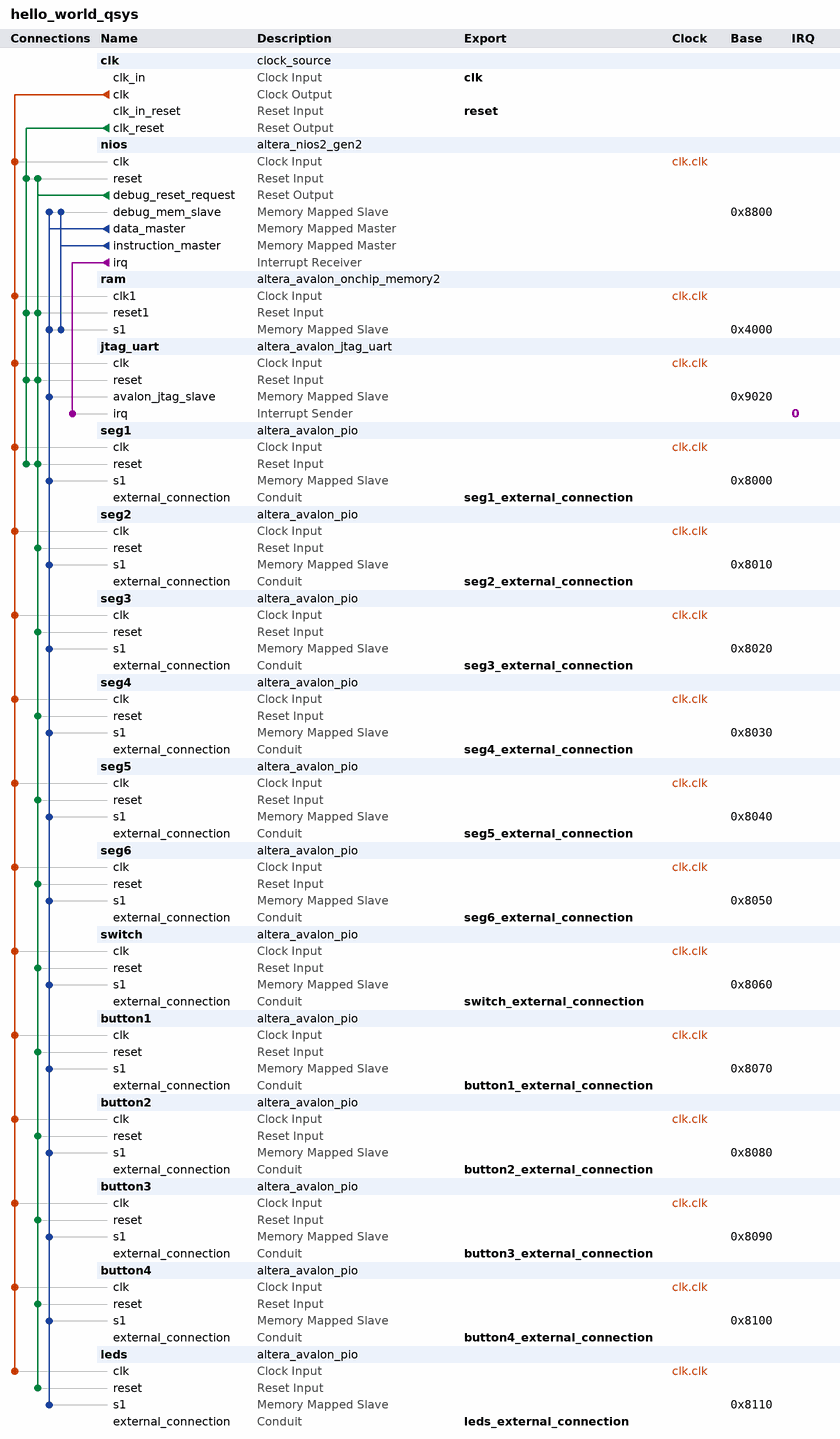
[diagram p0: system contents]
# Platform Designer (Qsys) system hello_world_qsys, Cyclone V 5CSEMA5F31C6
# Parameters at their usual value, and those the tool derives, are not listed.
package require -exact qsys 17.0
create_system hello_world_qsys
set_project_property DEVICE_FAMILY {Cyclone V}
set_project_property DEVICE 5CSEMA5F31C6

add_instance clk clock_source 17.0
set_instance_parameter_value clk clockFrequency 50000000

add_instance nios altera_nios2_gen2 17.0
set_instance_parameter_value nios dcache_size 2048
set_instance_parameter_value nios exceptionSlave ram.s1
set_instance_parameter_value nios icache_size 4096
set_instance_parameter_value nios impl Tiny
set_instance_parameter_value nios resetSlave ram.s1

add_instance ram altera_avalon_onchip_memory2 17.0
set_instance_parameter_value ram dataWidth 32
set_instance_parameter_value ram dualPort false
set_instance_parameter_value ram initMemContent false
set_instance_parameter_value ram initializationFileName onchip_mem.hex
set_instance_parameter_value ram memorySize 16384

add_instance jtag_uart altera_avalon_jtag_uart 17.0
set_instance_parameter_value jtag_uart simInteractiveOptions NO_INTERACTIVE_WINDOWS

add_instance seg1 altera_avalon_pio 17.0
set_instance_parameter_value seg1 direction Output
set_instance_parameter_value seg1 width 7

add_instance seg2 altera_avalon_pio 17.0
set_instance_parameter_value seg2 direction Output
set_instance_parameter_value seg2 width 7

add_instance seg3 altera_avalon_pio 17.0
set_instance_parameter_value seg3 direction Output
set_instance_parameter_value seg3 width 7

add_instance seg4 altera_avalon_pio 17.0
set_instance_parameter_value seg4 direction Output
set_instance_parameter_value seg4 width 7

add_instance seg5 altera_avalon_pio 17.0
set_instance_parameter_value seg5 direction Output
set_instance_parameter_value seg5 width 7

add_instance seg6 altera_avalon_pio 17.0
set_instance_parameter_value seg6 direction Output
set_instance_parameter_value seg6 width 7

add_instance switch altera_avalon_pio 17.0
set_instance_parameter_value switch direction Input
set_instance_parameter_value switch width 1

add_instance button1 altera_avalon_pio 17.0
set_instance_parameter_value button1 direction Input
set_instance_parameter_value button1 width 1

add_instance button2 altera_avalon_pio 17.0
set_instance_parameter_value button2 direction Input
set_instance_parameter_value button2 width 1

add_instance button3 altera_avalon_pio 17.0
set_instance_parameter_value button3 direction Input
set_instance_parameter_value button3 width 1

add_instance button4 altera_avalon_pio 17.0
set_instance_parameter_value button4 direction Input
set_instance_parameter_value button4 width 1

add_instance leds altera_avalon_pio 17.0
set_instance_parameter_value leds direction Output
set_instance_parameter_value leds width 5

# connections
add_connection clk.clk button1.clk clock
add_connection clk.clk button2.clk clock
add_connection clk.clk button3.clk clock
add_connection clk.clk button4.clk clock
add_connection clk.clk jtag_uart.clk clock
add_connection clk.clk leds.clk clock
add_connection clk.clk nios.clk clock
add_connection clk.clk ram.clk1 clock
add_connection clk.clk seg1.clk clock
add_connection clk.clk seg2.clk clock
add_connection clk.clk seg3.clk clock
add_connection clk.clk seg4.clk clock
add_connection clk.clk seg5.clk clock
add_connection clk.clk seg6.clk clock
add_connection clk.clk switch.clk clock
add_connection clk.clk_reset jtag_uart.reset reset
add_connection clk.clk_reset nios.reset reset
add_connection clk.clk_reset ram.reset1 reset
add_connection clk.clk_reset seg1.reset reset
add_connection nios.debug_reset_request button1.reset reset
add_connection nios.debug_reset_request button2.reset reset
add_connection nios.debug_reset_request button3.reset reset
add_connection nios.debug_reset_request button4.reset reset
add_connection nios.debug_reset_request jtag_uart.reset reset
add_connection nios.debug_reset_request leds.reset reset
add_connection nios.debug_reset_request nios.reset reset
add_connection nios.debug_reset_request ram.reset1 reset
add_connection nios.debug_reset_request seg1.reset reset
add_connection nios.debug_reset_request seg2.reset reset
add_connection nios.debug_reset_request seg3.reset reset
add_connection nios.debug_reset_request seg4.reset reset
add_connection nios.debug_reset_request seg5.reset reset
add_connection nios.debug_reset_request seg6.reset reset
add_connection nios.debug_reset_request switch.reset reset
add_connection nios.data_master button1.s1 avalon
set_connection_parameter_value nios.data_master/button1.s1 baseAddress 0x8070
add_connection nios.data_master button2.s1 avalon
set_connection_parameter_value nios.data_master/button2.s1 baseAddress 0x8080
add_connection nios.data_master button3.s1 avalon
set_connection_parameter_value nios.data_master/button3.s1 baseAddress 0x8090
add_connection nios.data_master button4.s1 avalon
set_connection_parameter_value nios.data_master/button4.s1 baseAddress 0x8100
add_connection nios.data_master jtag_uart.avalon_jtag_slave avalon
set_connection_parameter_value nios.data_master/jtag_uart.avalon_jtag_slave baseAddress 0x9020
add_connection nios.data_master leds.s1 avalon
set_connection_parameter_value nios.data_master/leds.s1 baseAddress 0x8110
add_connection nios.data_master nios.debug_mem_slave avalon
set_connection_parameter_value nios.data_master/nios.debug_mem_slave baseAddress 0x8800
add_connection nios.data_master ram.s1 avalon
set_connection_parameter_value nios.data_master/ram.s1 baseAddress 0x4000
add_connection nios.data_master seg1.s1 avalon
set_connection_parameter_value nios.data_master/seg1.s1 baseAddress 0x8000
add_connection nios.data_master seg2.s1 avalon
set_connection_parameter_value nios.data_master/seg2.s1 baseAddress 0x8010
add_connection nios.data_master seg3.s1 avalon
set_connection_parameter_value nios.data_master/seg3.s1 baseAddress 0x8020
add_connection nios.data_master seg4.s1 avalon
set_connection_parameter_value nios.data_master/seg4.s1 baseAddress 0x8030
add_connection nios.data_master seg5.s1 avalon
set_connection_parameter_value nios.data_master/seg5.s1 baseAddress 0x8040
add_connection nios.data_master seg6.s1 avalon
set_connection_parameter_value nios.data_master/seg6.s1 baseAddress 0x8050
add_connection nios.data_master switch.s1 avalon
set_connection_parameter_value nios.data_master/switch.s1 baseAddress 0x8060
add_connection nios.instruction_master nios.debug_mem_slave avalon
set_connection_parameter_value nios.instruction_master/nios.debug_mem_slave baseAddress 0x8800
add_connection nios.instruction_master ram.s1 avalon
set_connection_parameter_value nios.instruction_master/ram.s1 baseAddress 0x4000
add_connection nios.irq jtag_uart.irq interrupt
set_connection_parameter_value nios.irq/jtag_uart.irq irqNumber 0

# exported interfaces
add_interface button1_external_connection conduit end
set_interface_property button1_external_connection EXPORT_OF button1.external_connection
add_interface button2_external_connection conduit end
set_interface_property button2_external_connection EXPORT_OF button2.external_connection
add_interface button3_external_connection conduit end
set_interface_property button3_external_connection EXPORT_OF button3.external_connection
add_interface button4_external_connection conduit end
set_interface_property button4_external_connection EXPORT_OF button4.external_connection
add_interface clk clock sink
set_interface_property clk EXPORT_OF clk.clk_in
add_interface leds_external_connection conduit end
set_interface_property leds_external_connection EXPORT_OF leds.external_connection
add_interface reset reset sink
set_interface_property reset EXPORT_OF clk.clk_in_reset
add_interface seg1_external_connection conduit end
set_interface_property seg1_external_connection EXPORT_OF seg1.external_connection
add_interface seg2_external_connection conduit end
set_interface_property seg2_external_connection EXPORT_OF seg2.external_connection
add_interface seg3_external_connection conduit end
set_interface_property seg3_external_connection EXPORT_OF seg3.external_connection
add_interface seg4_external_connection conduit end
set_interface_property seg4_external_connection EXPORT_OF seg4.external_connection
add_interface seg5_external_connection conduit end
set_interface_property seg5_external_connection EXPORT_OF seg5.external_connection
add_interface seg6_external_connection conduit end
set_interface_property seg6_external_connection EXPORT_OF seg6.external_connection
add_interface switch_external_connection conduit end
set_interface_property switch_external_connection EXPORT_OF switch.external_connection

set_interconnect_requirement {$system} qsys_mm.clockCrossingAdapter HANDSHAKE
set_interconnect_requirement {$system} qsys_mm.enableEccProtection FALSE
set_interconnect_requirement {$system} qsys_mm.insertDefaultSlave FALSE
set_interconnect_requirement {$system} qsys_mm.maxAdditionalLatency 1

save_system hello_world_qsys.qsys
